# EAGLE design RNS_1board (EAGLE 9.5.1)
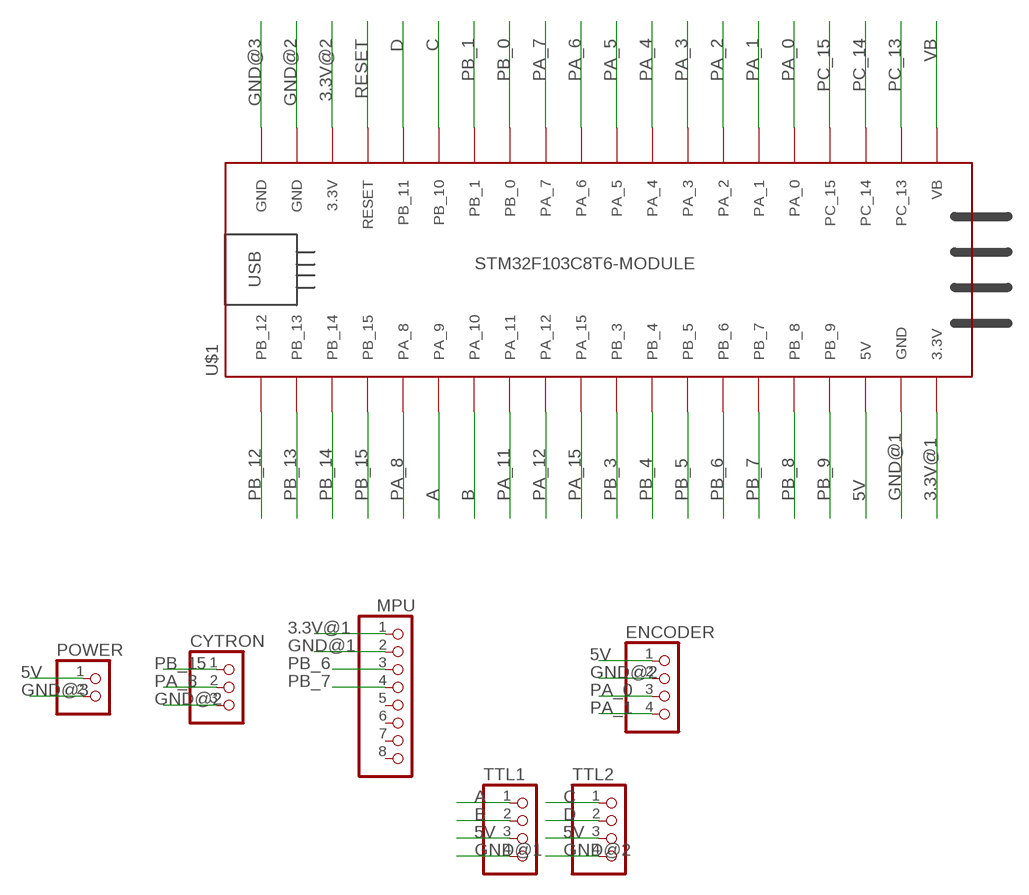
[diagram p0: schematic, sheet 1]

## Parts
CYTRON  PINHD-3_DATA  [1X03_DATA]
ENCODER  PINHD-4_DATA  [1X04_DATA]
MPU  PINHD-8_DATA  [1X08_DATA]
POWER  PINHD-2_DATA  [1X02_DATA]
TTL1  PINHD-4_DATA  [1X04_DATA]
TTL2  PINHD-4_DATA  [1X04_DATA]
U$1  STM32F103C8T6-MODULE  [STM32F103C8T6-MODULE]

## Nets
3.3V@1: MPU.1 U$1.3.3V_1(3.3V)
3.3V@2: U$1.3.3V_2(3.3V)
5V: ENCODER.1 POWER.1 TTL1.3 TTL2.3 U$1.5V
A: TTL1.1 U$1.PA_9
B: TTL1.2 U$1.PA_10
C: TTL2.1 U$1.PB_10
D: TTL2.2 U$1.PB_11
GND@1: MPU.2 TTL1.4 U$1.GND_1(GND)
GND@2: CYTRON.3 ENCODER.2 TTL2.4 U$1.GND_2(GND)
GND@3: POWER.2 U$1.GND_3(GND)
PA_0: ENCODER.3 U$1.PA_0
PA_1: ENCODER.4 U$1.PA_1
PA_2: U$1.PA_2
PA_3: U$1.PA_3
PA_4: U$1.PA_4
PA_5: U$1.PA_5
PA_6: U$1.PA_6
PA_7: U$1.PA_7
PA_8: CYTRON.2 U$1.PA_8
PA_11: U$1.PA_11
PA_12: U$1.PA_12
PA_15: U$1.PA_15
PB_0: U$1.PB_0
PB_1: U$1.PB_1
PB_3: U$1.PB_3
PB_4: U$1.PB_4
PB_5: U$1.PB_5
PB_6: MPU.3 U$1.PB_6
PB_7: MPU.4 U$1.PB_7
PB_8: U$1.PB_8
PB_9: U$1.PB_9
PB_12: U$1.PB_12
PB_13: U$1.PB_13
PB_14: U$1.PB_14
PB_15: CYTRON.1 U$1.PB_15
PC_13: U$1.PC_13
PC_14: U$1.PC_14
PC_15: U$1.PC_15
RESET: U$1.RESET
VB: U$1.VB
Unconnected: MPU.5 MPU.6 MPU.7 MPU.8

## Library data of the parts
CYTRON = MIA_LIBRARY-2-2-2:PINHD-3_DATA: PIN HEADER
ENCODER TTL1 TTL2 = MIA_LIBRARY-2-2-2:PINHD-4_DATA: PIN HEADER
MPU = MIA_LIBRARY-2-2-2:PINHD-8_DATA: PIN HEADER
POWER = MIA_LIBRARY-2-2-2:PINHD-2_DATA: PIN HEADER
U$1 = MIA_LIBRARY-2-2-2:STM32F103C8T6-MODULE: STM32F103C8T6 module with ARM Cortex-3, 20kB SRAM, 64kB Flash, 72MHz

## Board
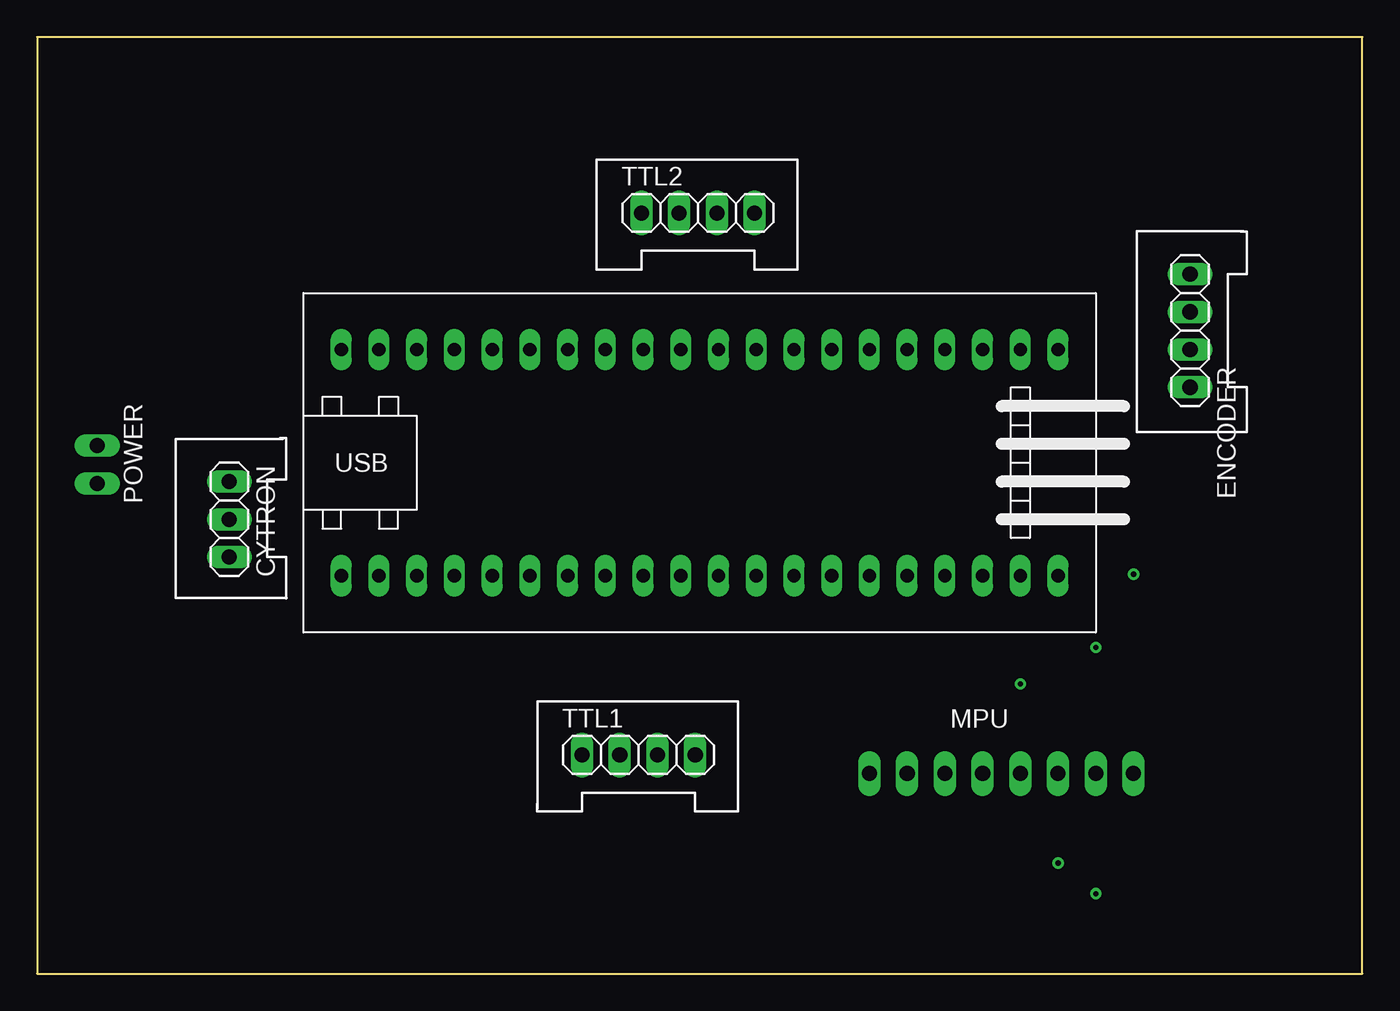
[diagram p1: board, top side]
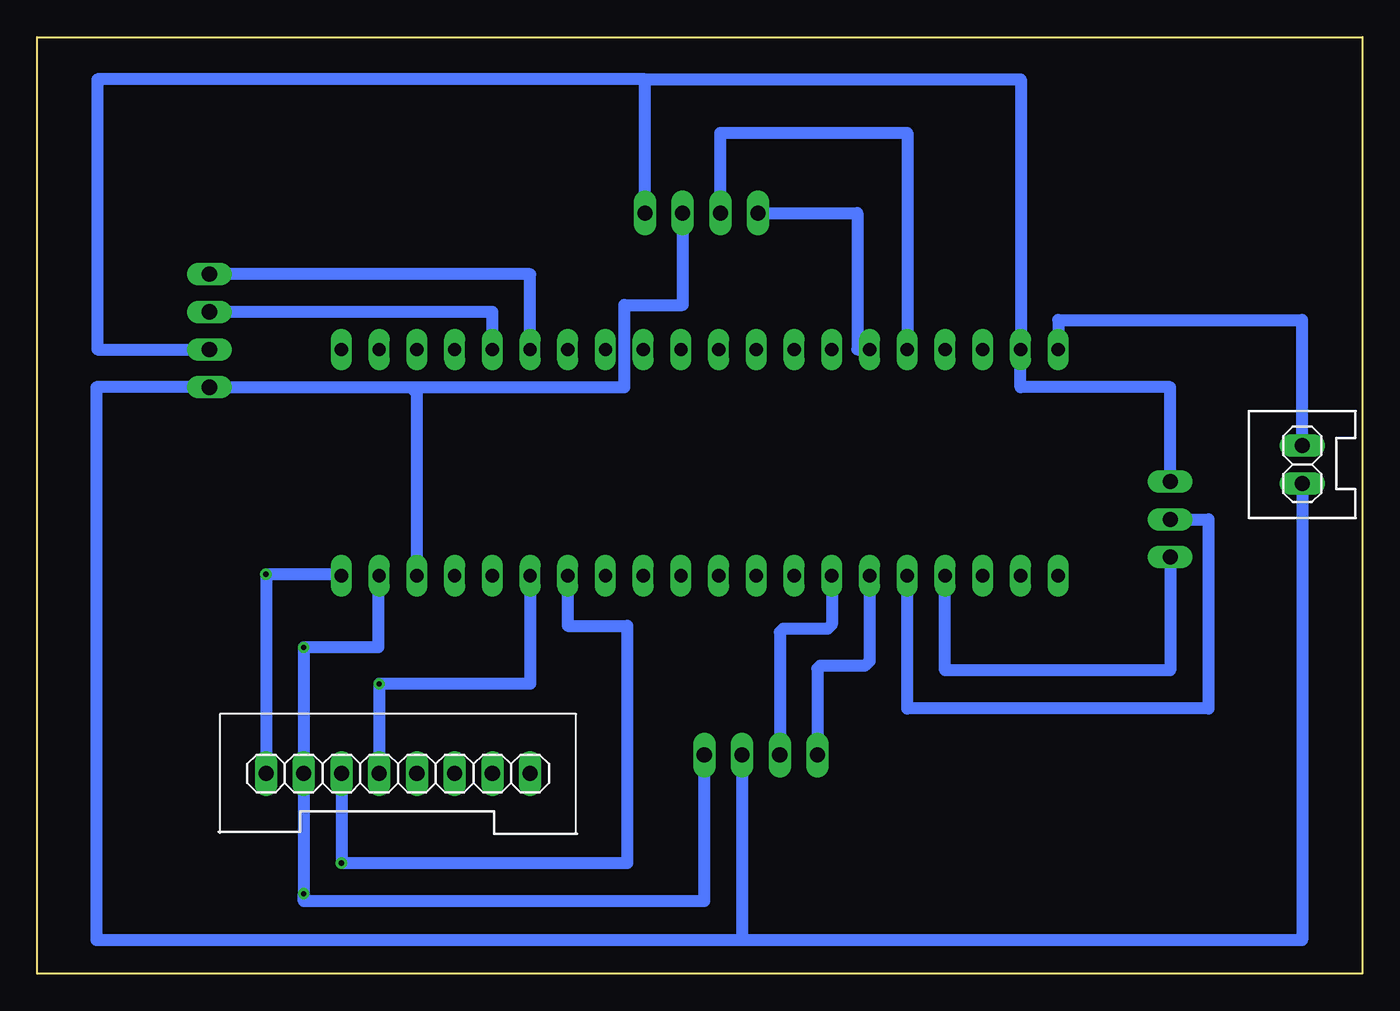
[diagram p2: board, bottom side, seen from below]

Size 89.23 x 63.07 mm. Coordinates in mm from the lower left corner, seen from the top.
Outline: 0,0 89.23,0 89.23,63.07 0,63.07 0,0
Copper layers (1*16): Top 0.035mm / dielectric 1.5mm / Bottom 0.035mm
Design rules "default": minimum track width 6mil, minimum drill 0.35mm, track to track 6mil, track to pad 6mil, pad to pad 6mil, via to via 6mil, smd to smd 6mil, copper to edge 40mil, drill to drill 6mil, minimum pad ring 10mil, minimum via ring 8mil, stop-mask expansion 4mil, vias tented up to drill 0mil, thermal gap 10mil

### Footprints (pad centres in the part's own frame; a part is rotated, then mirrored left to right if it is on the bottom)
1X03_DATA = drill 1.016 long: 1 -2.54,0; 2 0,0; 3 2.54,0
1X04_DATA = drill 1.016 long: 1 -3.81,0; 2 -1.27,0; 3 1.27,0; 4 3.81,0
1X08_DATA = drill 1.016 long: 1 -8.89,0; 2 -6.35,0; 3 -3.81,0; 4 -1.27,0; 5 1.27,0; 6 3.81,0; 7 6.35,0; 8 8.89,0
1X02_DATA = drill 1.016 long: 1 -1.27,0; 2 1.27,0
STM32F103C8T6-MODULE = drill 0.9 long: 3.3V_1 25.4,-7.62; 3.3V_2 -17.78,7.62; 5V 20.32,-7.62; GND_1 22.86,-7.62; GND_2 -20.32,7.62; GND_3 -22.86,7.62; PA_0 15.24,7.62; PA_1 12.7,7.62; PA_2 10.16,7.62; PA_3 7.62,7.62; PA_4 5.08,7.62; PA_5 2.54,7.62; PA_6 0,7.62; PA_7 -2.54,7.62; PA_8 -12.7,-7.62; PA_9 -10.16,-7.62; PA_10 -7.62,-7.62; PA_11 -5.08,-7.62; PA_12 -2.54,-7.62; PA_15 0,-7.62; PB_0 -5.08,7.62; PB_1 -7.62,7.62; PB_3 2.54,-7.62; PB_4 5.08,-7.62; PB_5 7.62,-7.62; PB_6 10.16,-7.62; PB_7 12.7,-7.62; PB_8 15.24,-7.62; PB_9 17.78,-7.62; PB_10 -10.16,7.62; PB_11 -12.7,7.62; PB_12 -22.86,-7.62; PB_13 -20.32,-7.62; PB_14 -17.78,-7.62; PB_15 -15.24,-7.62; PC_13 22.86,7.62; PC_14 20.32,7.62; PC_15 17.78,7.62; RESET -15.24,7.62; VB 25.4,7.62

### Placement (x,y rotation side)
CYTRON  12.94,30.6 90 top
ENCODER  77.63,43.3 90 top
MPU  64.93,13.48 0 bottom
POWER  4.05,34.29 90 bottom
TTL1  40.5,14.73 0 top
TTL2  44.5,51.23 0 top
U$1  43.34,34.41 0 top

### Tracks (layer width: path | path; a pad name or v marks a point on that pad's centre or on a via)
3.3V@1  (via drill 0.35)
  Bottom 0.813: U$1.3.3V_1 68.85,26.9 v73.82,26.9 MPU.1
5V
  Bottom 0.813: POWER.1 4.05,2.28 41.5,2.28 | U$1.5V 63.66,39.06 64.09,39.49 | 64.09,39.49 ENCODER.1 85.25,39.49 85.25,2.28 41.5,2.28 | TTL1.3 41.77,2.55 41.5,2.28 | 64.09,39.49 49.68,39.49 49.68,45.03 45.77,45.03 TTL2.3
A
  Bottom 0.813: U$1.PA_9 33.18,21.05 33.5,20.73 36.5,20.73 36.69,20.54 TTL1.1
B
  Bottom 0.813: U$1.PA_10 35.72,23.51 36,23.23 39,23.23 39.23,23 TTL1.2
C
  Bottom 0.813: TTL2.1 34,51.23 34,42.03 U$1.PB_10
D
  Bottom 0.813: TTL2.2 43.23,56.63 30.64,56.63 U$1.PB_11
GND@1  (via drill 0.35)
  Bottom 0.813: 66.2,26.48 U$1.GND_1 66.26,26.73 66.26,21.98 v71.28,21.98 MPU.2 v71.28,5.39 71.28,4.89 44.32,4.89 TTL1.4
GND@2
  Bottom 0.813: CYTRON.3 12.94,39.49 23.02,39.49 U$1.GND_2 23,42.05 23,60.23 48.31,60.23 | ENCODER.2 85.17,42.03 85.17,60.23 48.31,60.23 | TTL2.4 48.31,60.23
GND@3
  Bottom 0.813: POWER.2 4.05,44.03 20.48,44.03 U$1.GND_3
PA_0
  Bottom 0.813: U$1.PA_0 58.58,44.57 ENCODER.3
PA_1
  Bottom 0.813: U$1.PA_1 56.04,47.11 ENCODER.4
PA_8
  Bottom 0.813: CYTRON.2 10.36,30.6 10.36,17.86 30.64,17.86 U$1.PA_8
PB_6  (via drill 0.35)
  Bottom 0.813: MPU.3 v68.74,7.45 49.5,7.45 49.5,23.43 53.5,23.43 U$1.PB_6
PB_7  (via drill 0.35)
  Bottom 0.813: U$1.PB_7 56.04,19.52 v66.2,19.52 MPU.4
PB_15
  Bottom 0.813: CYTRON.1 12.94,20.44 28.1,20.44 U$1.PB_15